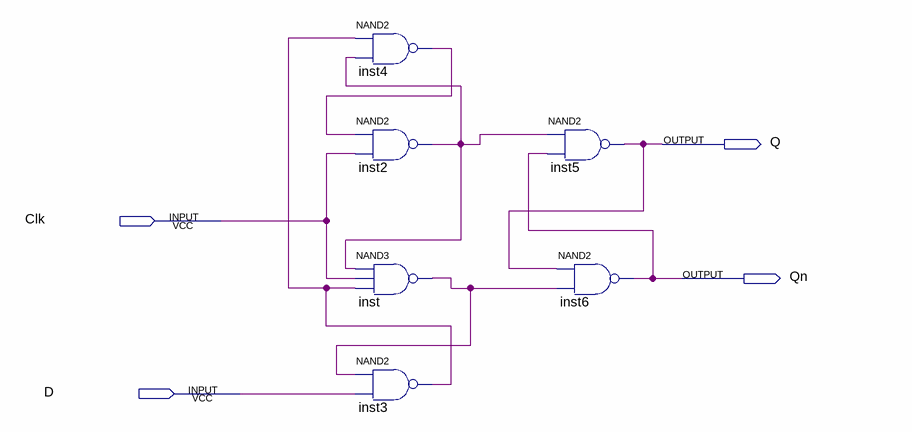
[diagram p0: schematic sheet]
// Quartus schematic gatedDLatch.bdf as structural Verilog: 6 symbols, 4 pins
module gatedDLatch (
  input  Clk,
  input  D,
  output Q,
  output Qn
);

  wire inst2_out, inst3_out, inst4_out, inst_out;

  nand inst4 (inst4_out, inst3_out, inst2_out);
  nand inst2 (inst2_out, inst4_out, Clk);
  nand inst (inst_out, inst2_out, Clk, inst3_out);
  nand inst3 (inst3_out, inst_out, D);
  nand inst5 (Q, inst2_out, Qn);
  nand inst6 (Qn, Q, inst_out);
endmodule
